# EAGLE schematic gainer_v1 (EAGLE 4.16)
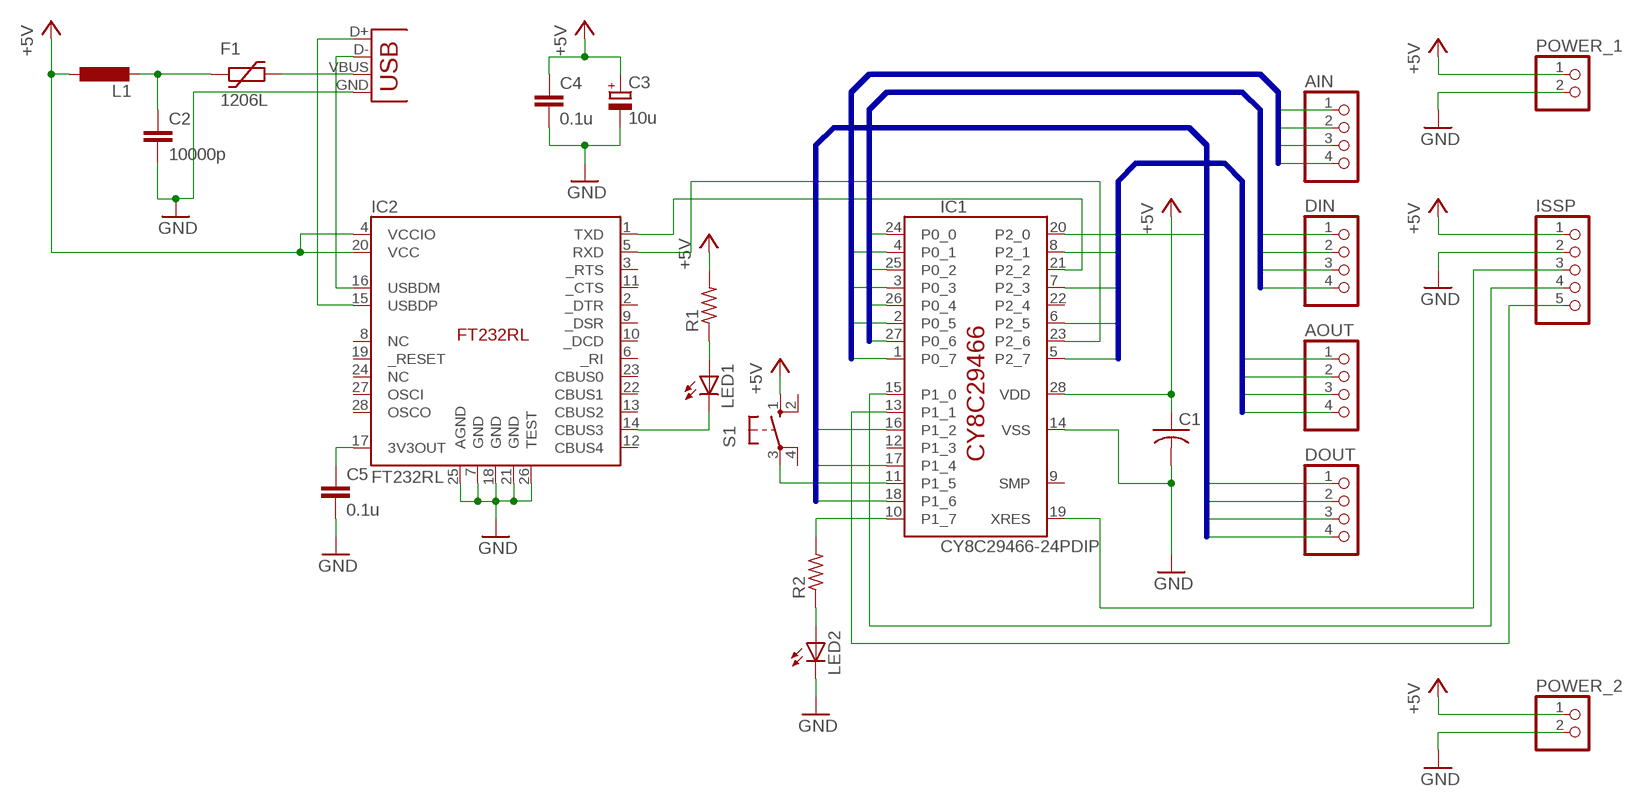
[diagram p0: schematic, sheet 1]

## Parts
AIN  PINHD-1X4  [1X04]
AOUT  PINHD-1X4  [1X04]
C1  C-US025-024X044  [C025-024X044]
C2  10000p  C-EU025-024X044  [C025-024X044]
C3  10u  CPOL-EUE1.8-4  [E1,8-4]
C4  0.1u  C-EU025-024X044  [C025-024X044]
C5  0.1u  C-EU025-024X044  [C025-024X044]
DIN  PINHD-1X4  [1X04]
DOUT  PINHD-1X4  [1X04]
F1  1206L  [1206L]
IC1  CY8C29466-24PDIP  [PDIP28]
IC2  FT232RL  [SSOP-28]
ISSP  PINHD-1X5  [1X05]
L1  L-EUL2012C  [L2012C]
LED1  LED3MM  [LED3MM]
LED2  LED3MM  [LED3MM]
POWER_1  PINHD-1X2  [1X02]
POWER_2  PINHD-1X2  [1X02]
R1  R-US_0204/5  [0204/5]
R2  R-US_0204/5  [0204/5]
S1  10-XX  [B3F-10XX]
X1  USB-B-H  [USB-B-H]

## Nets
+5V: C1.1 C3.+ C4.1 IC1.28(VDD) IC2.4(VCCIO) IC2.20(VCC) ISSP.1 L1.1 POWER_1.1 POWER_2.1 R1.2 S1.1(S)
AIN1: AIN.1 IC1.1(P0_7)
AIN2: AIN.2 IC1.2(P0_5)
AIN3: AIN.3 IC1.3(P0_3)
AIN4: AIN.4 IC1.4(P0_1)
AOUT1: AOUT.1 IC1.5(P2_7)
AOUT2: AOUT.2 IC1.6(P2_5)
AOUT3: AOUT.3 IC1.7(P2_3)
AOUT4: AOUT.4 IC1.8(P2_1)
DIN1: DIN.1 IC1.27(P0_6)
DIN2: DIN.2 IC1.26(P0_4)
DIN3: DIN.3 IC1.25(P0_2)
DIN4: DIN.4 IC1.24(P0_0)
DOUT1: DOUT.1 IC1.20(P2_0)
DOUT2: DOUT.2 IC1.18(P1_6)
DOUT3: DOUT.3 IC1.17(P1_4)
DOUT4: DOUT.4 IC1.16(P1_2)
GND: C1.2 C2.2 C3.- C4.2 C5.2 IC1.14(VSS) IC2.7(GND) IC2.18(GND) IC2.21(GND) IC2.25(AGND) IC2.26(TEST) ISSP.2 LED2.K(C) POWER_1.2 POWER_2.2 X1.GND
N$1: LED1.A R1.1
N$2: IC2.14(CBUS3) LED1.K(C)
N$3: IC2.16(USBDM) X1.D-
N$4: IC1.21(P2_2) IC2.1(TXD)
N$5: IC1.23(P2_6) IC2.5(RXD)
N$6: IC2.15(USBDP) X1.D+
N$8: IC1.11(P1_5) S1.3(P)
N$9: IC1.10(P1_7) R2.2
N$10: LED2.A R2.1
N$11 [+5v]: F1.P$2 X1.VBUS
N$12: IC1.19(XRES) ISSP.3
N$13 [+5v]: C2.1 F1.P$1 L1.2
N$14: IC1.15(P1_0) ISSP.4
N$15: IC1.13(P1_1) ISSP.5
N$17: C5.1 IC2.17(3V3OUT)
Unconnected: IC1.9(SMP) IC1.12(P1_3) IC1.22(P2_4) IC2.2(_DTR) IC2.3(_RTS) IC2.6(_RI) IC2.8(NC) IC2.9(_DSR) IC2.10(_DCD) IC2.11(_CTS) IC2.12(CBUS4) IC2.13(CBUS2) IC2.19(_RESET) IC2.22(CBUS1) IC2.23(CBUS0) IC2.24(NC) IC2.27(OSCI) IC2.28(OSCO) S1.2(S1) S1.4(P1)

## Buses
AIN[1..4]
DIN[1..4]
AOUT[1..4]
DOUT[1..4]

## Library data of the parts
AIN AOUT DIN DOUT = pinhead-small:PINHD-1X4: PIN HEADER
C1 = rcl:C-US: CAPACITOR, American symbol
C2 C4 C5 = rcl:C-EU: CAPACITOR, European symbol
C3 = rcl:CPOL-EU: POLARIZED CAPACITOR, European symbol
F1 = ptc-littlefuse:1206L
IC1 = cypress-psoc:CY8C29466-24*
IC2 = ftdi:FT232RL
ISSP = pinhead-small:PINHD-1X5: PIN HEADER
L1 = rcl:L-EU: INDUCTOR, European symbol
LED1 LED2 = led:LED: LED OSRAM: - CHIPLED LG R971, LG N971, LY N971, LG Q971, LY Q971, LO R971, LY R971 LH N974, LH R974 LS Q976, LO Q976, LY Q976 LO Q996 - Hyper CHIPLED LW Q18S LB Q993, LB Q99A, LB R99A - SideLED LS A670, LO A670, LY A670, LG A670, LP A670 LB A673, LV A673, LT A673, LW A673 LH A674 LY A675 LS A676, LA A676, LO A676, LY A676, LW A676 LS A679, LY A679, LG A679 - Hyper Micro SIDELED® LS Y876, LA Y876, LO Y876, LY Y876 LT Y87S - SmartLED LW L88C, LW L88S LB L89C, LB L89S, LG L890 LS L89K, LO L89K, LY L89K LS L896, LA L896, LO L896, LY L896 - TOPLED LS T670, LO T670, LY T670, LG T670, LP T670 LSG T670, LSP T670, LSY T670, LOP T670, LYG T670 LG T671, LOG T671, LSG T671 LB T673, LV T673, LT T673, LW T673 LH T674 LS T676, LA T676, LO T676, LY T676, LB T676, LH T676, LSB T676, LW T676 LB T67C, LV T67C, LT T67C, LS T67K, LO T67K, LY T67K, LW E67C LS E67B, LA E67B, LO E67B, LY E67B, LB E67C, LV E67C, LT E67C LW T67C LS T679, LY T679, LG T679 LS T770, LO T770, LY T770, LG T770, LP T770 LB T773, LV T773, LT T773, LW T773 LH T774 LS E675, LA E675, LY E675, LS T675 LS T776, LA T776, LO T776, LY T776, LB T776 LHGB T686 LT T68C, LB T68C - Hyper Mini TOPLED® LB M676 - Mini TOPLED Santana® LG M470 LS M47K, LO M47K, LY M47K Source: http://www.osram.convergy.de/
POWER_1 POWER_2 = pinhead-small:PINHD-1X2: PIN HEADER
R1 R2 = rcl:R-US_: RESISTOR, American symbol
S1 = switch-omron:10-XX: OMRON SWITCH
X1 = con-usb:USB: USB Connectors

## Net classes
1 +5v: width 0.813 mm
2 GND: width 0.813 mm